# Altium project FMC_SDR_XFE.PrjPcb (part 1 of 2)
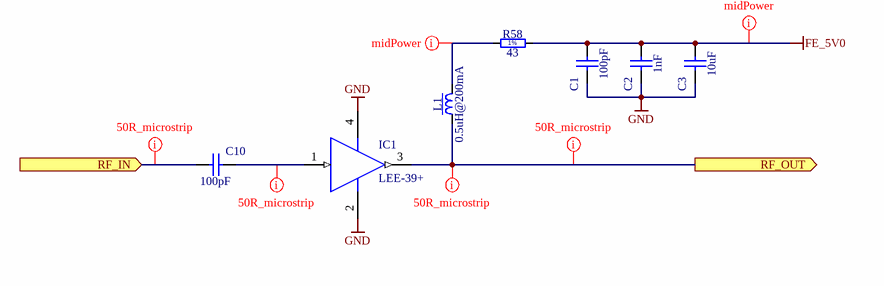
[diagram p0: Preamp.SchDoc]
7 sheets, 141 parts. Net scope: hierarchical (ports join the sheet entries above them; power ports are global).
Board file: FMC_SDR_XFE.PcbDoc
Sheets:
  Preamp.SchDoc
  FrontEnd_PS.SchDoc
    INV_neg5V_PA = LTM8074neg_PA.SchDoc
    INV_neg5V = LTM8074neg.SchDoc
    FE_LDOs = FE_LDOs.SchDoc
    FE_PA_LDOs = FE_PA_LDOs.SchDoc
      PA_LDO = LT3080.SchDoc

## Sheet Preamp.SchDoc: FMC SDR Frontend
size 420 x 297 mm; CheckedBy: -; CompanyName: CERN; DrawnBy: DrawnBy; Organization: CERN; Address1: European Organization for Nuclear Research; Address2: CH-1211 Genčve 23 - Switzerland; Revision: -; SheetNumber: -; SheetTotal: -; EDA_Number: EDA-XXXXX-VX-X; Projet: -; ModifiedBy: -; CreateDate: XX/XX/XXXX; CheckedDate: -; Title2: Preamplifier - general GND reference; DivGrp: TE/MPE; Designer: Designer; ModifiedDate: -

### Parts
C1  100pF  [CAPC1005X55N]
C2  1nF  [CAPC1005X55N]
C3  10uF  [CAPC3216X180N]
C10  100pF  [CAPC1005X55N]
IC1  LEE-39+  [MINI-CIRCUITS_FG873]
L1  0.5uH@200mA  [IND_MINI-CIRCUITS_GU1604]
R58  43  [RESC1608X55N]

### Ports
RF_IN (in), RF_OUT (out)

### Nets
FE_5V0: C1.2 C2.2 C3.2 R58.2
GND: C1.1 C2.1 C3.1 IC1.2(GND) IC1.4(GND)
NetC10_1: C10.1 ; port RF_IN
NetC10_2: C10.2 IC1.1(RF_IN)
NetIC1_3: IC1.3(RF_OUT) L1.1 ; port RF_OUT
NetL1_3: L1.3 R58.1

### Layout directives
net class midPower: FE_5V0, NetL1_3
net class 50R_class: NetC10_1, NetC10_2, NetIC1_3
net class 50R_class; rule Clearance Constraint [Generic clearance = 0.15mm, and 26 value(s) for objects]: NetIC1_3

### Notes on the sheet
- Project/Equipment
- Document
- Designer
- Drawn by
- Check.by
- File
- Last Mod.
- Print Date
- Sheet
- Size
- A3
- of
- Rev
- (in symbol R0603_43R_1%_0.1W_100PPM) 1%

### Library data of the parts
C1 C10 = CC0402_100PF_50V_5%_C0G: Non-polarised capacitor; Part Description: SMD Multilayer Chip Ceramic Capacitor; Manufacturer: GENERIC; Manufacturer1 Part Number: C0402C101J5GACTU; Voltage: 50V; TC: C0G/NP0; Tolerance: ±5%; Part Number: CC0402_100PF_50V_5%_C0G; Component Kind: Standard; Component Type: Standard; Pin Count: 2; Value: 100pF; Status: Preferred; Manufacturer Part Number: CC0402_100PF_50V_5%_C0G; Case: 0402; Mounted: Yes; Socket: No; SMD: Yes; Sense: No; Manufacturer1 Example: KEMET; Manufacturer1 ComponentHeight: 0.55mm; HelpURL: \\cern.ch\dfs\Applications\Altium\Datasheets\CC0805_C0G_KEMET_(Commercial Grade).pdf; Author: CERN DEM JLC; CreateDate: 03.12.2007; LatestRevisionDate: 22.04.2015
C2 = CC0402_1NF_50V_10%_X7R: Non-polarised capacitor; Part Description: SMD Multilayer Chip Ceramic Capacitor; Manufacturer: GENERIC; Manufacturer1 Part Number: 223858715623; Voltage: 50V; TC: X7R; Tolerance: ±10%; Part Number: CC0402_1NF_50V_10%_X7R; Component Kind: Standard; Component Type: Standard; Pin Count: 2; Value: 1nF; Status: Not Recommended; Manufacturer Part Number: CC0402_1NF_50V_10%_X7R; Case: 0402; Mounted: Yes; Socket: No; SMD: Yes; Sense: No; Manufacturer1 Example: PHYCOMP; Manufacturer1 ComponentHeight: 0.55mm; HelpURL: \\cern.ch\dfs\Applications\Altium\Datasheets\CC0402_X7R_PHYCOMP.pdf; Author: CERN DEM JLC; CreateDate: 03.12.2007; LatestRevisionDate: 03.12.2007
C3 = CC1206_10UF_25V_10%_X7R: Non-polarised capacitor; Part Description: SMD Multilayer Chip Ceramic Capacitor; Manufacturer: GENERIC; Manufacturer1 Part Number: C1206C106K4RACTU; Voltage: 25V; TC: X7R; Tolerance: ±10%; Part Number: CC1206_10UF_25V_10%_X7R; Component Kind: Standard; Component Type: Standard; Pin Count: 2; Value: 10uF; Status: Preferred; Manufacturer Part Number: CC1206_10uF_25V_10%_X7R; Case: 1206; Mounted: Yes; Socket: No; SMD: Yes; Sense: No; Manufacturer1 Example: KEMET; Manufacturer1 ComponentHeight: 1.8mm; HelpURL: \\cern.ch\dfs\Applications\Altium\Datasheets\CC1206_X7R_KEMET.pdf; Author: CERN DEM JLC; CreateDate: 12.09.2012; LatestRevisionDate: 12.09.2012
IC1 = LEE-39+: Monolithic Amplifier; Part Description: DC-8GHz Monolithic Amplifier; Manufacturer: MINI-CIRCUITS; PressFit: No; Bonding: No; Part Number: LEE-39+; Component Kind: Standard; Component Type: Standard; Device: LEE-39+; PackageDescription: MINI-CIRCUITS FG873 Case, 4 pin, 3.0mm W X 3.0mm L; Manufacturer Part Number: LEE-39+; Pin Count: 4; Mounted: Yes; Socket: No; SMD: Yes; Sense: No; ComponentHeight: 0.89mm; Author: CERN DEM JLC; HelpURL: \\cern.ch\dfs\Applications\Altium\Datasheets\LEE-39+.pdf; ComponentLink1URL: \\cern.ch\dfs\Applications\Altium\Datasheets\LEE-39+_Package-Drawing.pdf; ComponentLink1Description: Package Drawing; CreateDate: 17.01.2017; LatestRevisionDate: 17.01.2017
L1 = IND_MINI-CIRCUITS_TCCH-80+: 50 Ohms, 50 to 8200 MHz RF Choke; Power: 200mA; Resistance: 0.1R; Part Number: IND_MINI-CIRCUITS_TCCH-80+; Component Kind: Standard; Component Type: Standard; Pin Count: 4; Value: 0.5uH@200mA; Status: None; Part Description: 50 Ohms, 50 to 8200 MHz RF Choke; Manufacturer: MINI-CIRCUITS; Manufacturer Part Number: TCCH-80+; Mounted: Yes; Socket: No; SMD: Yes; Sense: No; ComponentHeight: 3.81mm; HelpURL: \\cern.ch\dfs\Applications\Altium\Datasheets\IND_MINI-CIRCUITS_TCCH-80+.pdf; Author: CERN DEM JLC; CreateDate: 19.12.2011; LatestRevisionDate: 19.12.2011
R58 = R0603_43R_1%_0.1W_100PPM: Resistor - 1%; Part Description: General Purpose Thick Film Chip Resistor; Manufacturer: GENERIC; Manufacturer1 Part Number: NRC06F43R0TRF; Power: 0.1W; TC: ±100ppm/°C; PressFit: No; Part Number: R0603_43R_1%_0.1W_100PPM; Component Kind: Standard; Component Type: Standard; Pin Count: 2; Value: 43; Status: Preferred; Tolerance: ±1%; Manufacturer Part Number: R0603_43R_1%_0.1W_100PPM; Case: 0603; Mounted: Yes; Sense: No; Socket: No; SMD: Yes; Manufacturer1 Example: NIC COMPONENT; Manufacturer1 ComponentHeight: 0.55mm; HelpURL: \\cern.ch\dfs\Applications\Altium\Datasheets\R0603_NIC_NRC.pdf; Author: CERN DEM JLC; CreateDate: 03.12.2007; LatestRevisionDate: 13.03.2008

## Sheet FrontEnd_PS.SchDoc: FMC SDR Frontend
size 420 x 297 mm; CheckedBy: -; CompanyName: CERN; DrawnBy: DrawnBy; Organization: CERN; Address1: European Organization for Nuclear Research; Address2: CH-1211 Genčve 23 - Switzerland; Revision: -; SheetNumber: -; SheetTotal: -; EDA_Number: EDA-XXXXX-VX-X; Projet: -; ModifiedBy: -; CreateDate: XX/XX/XXXX; CheckedDate: -; Title2: Power Supply Top sheet; DivGrp: TE/MPE; Designer: Designer; ModifiedDate: -
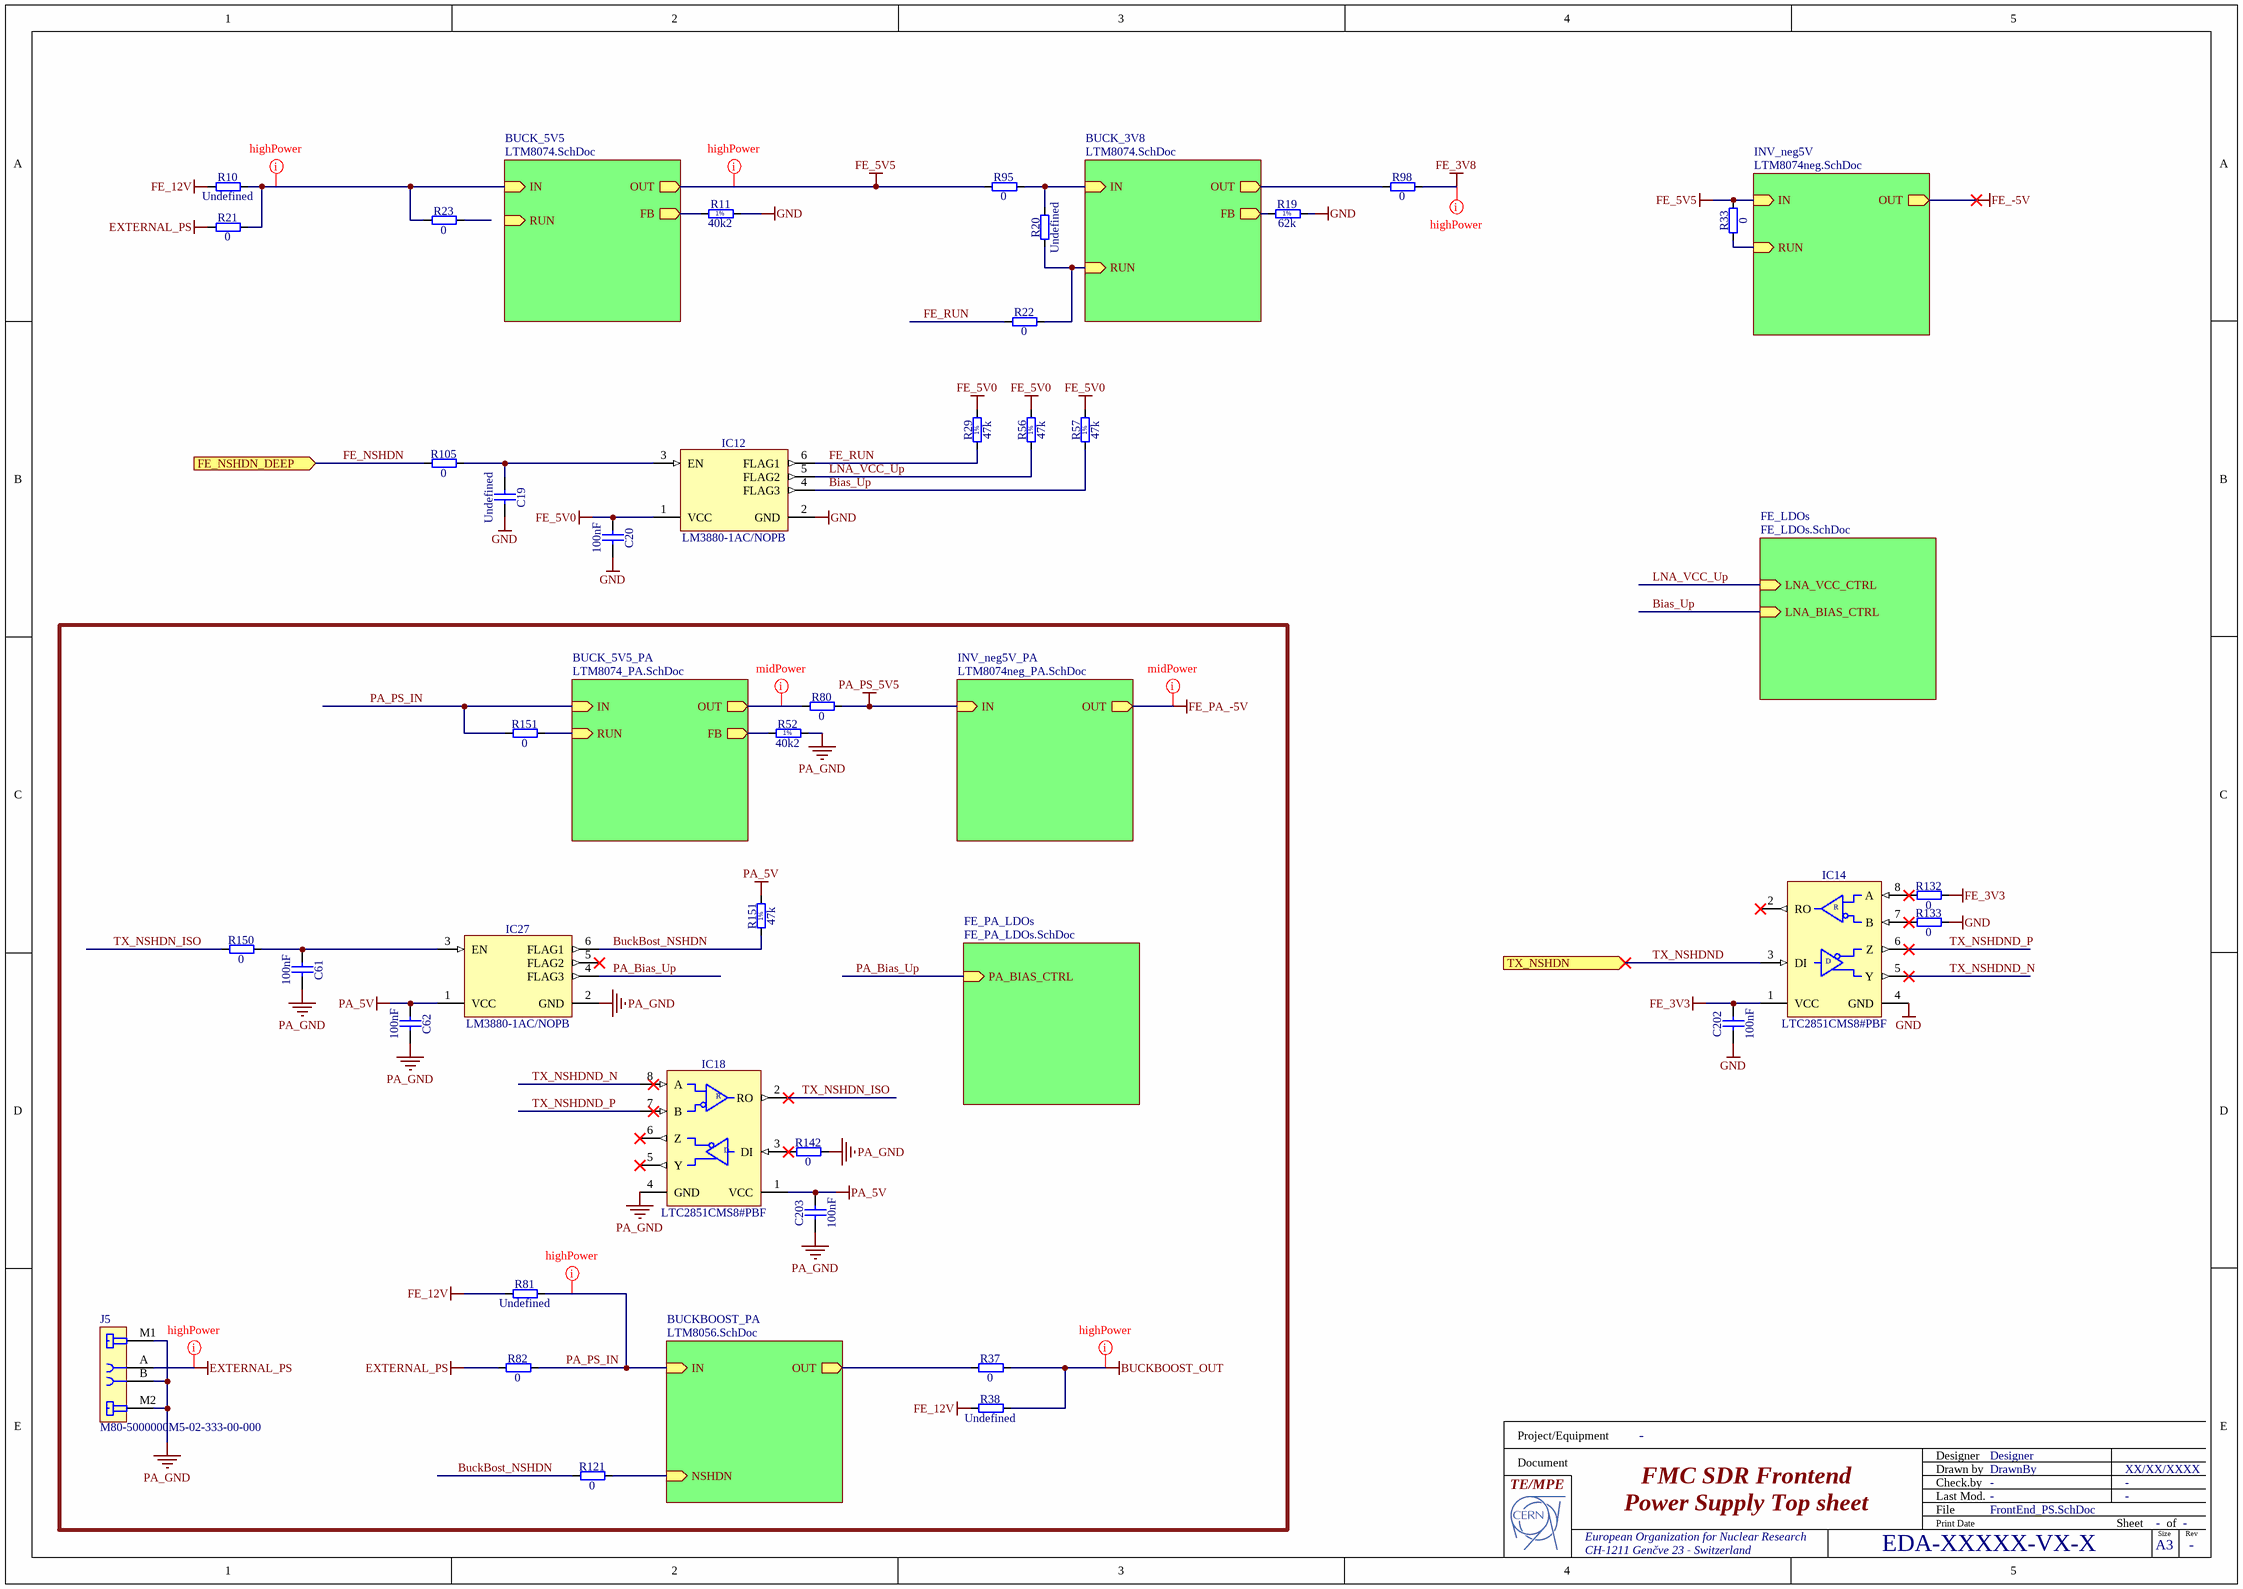
[diagram p1: FrontEnd_PS.SchDoc]

### Parts
(Parts that share a designator on the sheet are numbered #1, #2 ... from top to bottom, then left to right.)
C19  Undefined  [CAPC1005X55N]
C20  100nF  [CAPC1005X55N]
C61  100nF  [CAPC1005X55N]
C62  100nF  [CAPC1005X55N]
C202  100nF  [CAPC1005X55N]
C203  100nF  [CAPC1005X55N]
IC12  LM3880-1AC/NOPB  [SOT95P280X145-6N]
IC14  LTC2851CMS8#PBF  [SOP65P490X110-8N]
IC18  LTC2851CMS8#PBF  [SOP65P490X110-8N]
IC27  LM3880-1AC/NOPB  [SOT95P280X145-6N]
J5  M80-5000000M5-02-333-00-000  [M80-5000000M5-02-333-00-000]
R10  Undefined  [RESC3216X65N]
R11  40k2  [RESC2012X60N]
R19  62k  [RESC2012X60N]
R20  Undefined  [RESC1608X55N]
R21  0  [RESC3216X65N]
R22#1  0  [RESC1608X55N]
R23#1  0  [RESC1608X55N]
R29  47k  [RESC1608X55N]
R33  0  [RESC1608X55N]
R37  0  [RESC3216X65N]
R38  Undefined  [RESC3216X65N]
R52  40k2  [RESC2012X60N]
R56  47k  [RESC1608X55N]
R57  47k  [RESC1608X55N]
R80  0  [RESC3216X65N]
R81  Undefined  [RESC3216X65N]
R82  0  [RESC3216X65N]
R95  0  [RESC3216X65N]
R98  0  [RESC3216X65N]
R105  0  [RESC1608X55N]
R121  0  [RESC1608X55N]
R132  0  [RESC1608X55N]
R133  0  [RESC1608X55N]
R142  0  [RESC1608X55N]
R150  0  [RESC1608X55N]
R151#1  0  [RESC1608X55N]
R151#2  47k  [RESC1608X55N]

### Sub-sheets
BUCK_3V8 = LTM8074.SchDoc (file not in this document): IN (in), OUT (out), FB (out), RUN (in)
BUCK_5V5 = LTM8074.SchDoc (file not in this document): IN (in), OUT (out), FB (out), RUN (in)
BUCK_5V5_PA = LTM8074_PA.SchDoc (file not in this document): IN (in), OUT (out), FB (out), RUN (in)
BUCKBOOST_PA = LTM8056.SchDoc (file not in this document): IN (in), OUT (out), NSHDN (in)
FE_LDOs = FE_LDOs.SchDoc: LNA_VCC_CTRL (in), LNA_BIAS_CTRL (in)
FE_PA_LDOs = FE_PA_LDOs.SchDoc: PA_BIAS_CTRL (in)
INV_neg5V = LTM8074neg.SchDoc: IN (in), OUT (out), RUN (in)
INV_neg5V_PA = LTM8074neg_PA.SchDoc: IN (in), OUT (out)

### Ports
FE_NSHDN_DEEP (in), TX_NSHDN (in)

### Nets
BUCKBOOST_OUT: R37.2 R38.2
EXTERNAL_PS: J5.A R21.1 R82.1
FE_3V3: C202.2 IC14.1(VCC) R132.2
FE_3V8: R98.2
FE_5V0: C20.2 IC12.1(VCC) R29.2 R56.2 R57.2
FE_5V5: R33.2 R95.1 ; sheet INV_neg5V/IN, sheet BUCK_5V5/OUT
FE_12V: R10.1 R38.1 R81.1
GND: C19.1 C20.1 C202.1 IC12.2(GND) IC14.4(GND) R11.2 R19.2 R133.2
PA_5V: C62.2 C203.2 IC18.1(VCC) IC27.1(VCC) R151#2.2
PA_GND: C61.1 C62.1 C203.1 IC18.4(GND) IC27.2(GND) J5.B J5.M1 J5.M2 R52.2 R142.2
PA_PS_5V5: R80.2 ; sheet INV_neg5V_PA/IN
Bias_Up: IC12.4(FLAG3) R57.1 ; sheet FE_LDOs/LNA_BIAS_CTRL
BuckBost_NSHDN: IC27.6(FLAG1) R121.1 R151#2.1
FE_NSHDN: R105.1 ; port FE_NSHDN_DEEP
FE_RUN: IC12.6(FLAG1) R22#1.1 R29.1
LNA_VCC_Up: IC12.5(FLAG2) R56.1 ; sheet FE_LDOs/LNA_VCC_CTRL
PA_Bias_Up: IC27.4(FLAG3) ; sheet FE_PA_LDOs/PA_BIAS_CTRL
PA_PS_IN: R81.2 R82.2 R151#1.1 ; sheet BUCKBOOST_PA/IN, sheet BUCK_5V5_PA/IN
TX_NSHDN_ISO: IC18.2(RO) R150.1
TX_NSHDND: IC14.3(DI) ; port TX_NSHDN
TX_NSHDND_N: IC14.5(Y) IC18.8(A)
TX_NSHDND_P: IC14.6(Z) IC18.7(B)
NetC19_2: C19.2 IC12.3(EN) R105.2
NetC61_2: C61.2 IC27.3(EN) R150.2
NetIC13_A2: R33.1 ; sheet INV_neg5V/RUN
NetIC14_7: IC14.7(B) R133.1
NetIC14_8: IC14.8(A) R132.1
NetIC18_3: IC18.3(DI) R142.1
NetR10_2: R10.2 R21.2 R23#1.1 ; sheet BUCK_5V5/IN
NetR11_1: R11.1 ; sheet BUCK_5V5/FB
NetR19_1: R19.1 ; sheet BUCK_3V8/FB
NetR20_1: R20.1 R22#1.2 ; sheet BUCK_3V8/RUN
NetR20_2: R20.2 R95.2 ; sheet BUCK_3V8/IN
NetR37_1: R37.1 ; sheet BUCKBOOST_PA/OUT
NetR52_1: R52.1 ; sheet BUCK_5V5_PA/FB
NetR80_1: R80.1 ; sheet BUCK_5V5_PA/OUT
NetR98_1: R98.1 ; sheet BUCK_3V8/OUT
NetR121_2: R121.2 ; sheet BUCKBOOST_PA/NSHDN
NetR151#1_2: R151#1.2 ; sheet BUCK_5V5_PA/RUN

Not connected (* = marked no-connect by the designer): IC14 2(RO)*; IC18 5(Y)* 6(Z)*; IC27 5(FLAG2)*; R23#1 2

### Layout directives
net class highPower: BUCKBOOST_OUT, EXTERNAL_PS, FE_3V8, FE_5V5, NetR10_2, PA_PS_IN
net class midPower: FE_PA_-5V, NetR80_1

### Notes on the sheet
- (near R37) Now 20V.
- Project/Equipment
- Document
- Designer
- Drawn by
- Check.by
- File
- Last Mod.
- Print Date
- Sheet
- Size
- A3
- of
- Rev
- (in symbol LTC2851CMS8#PBF) R; D
- (in symbol R0603_47K_1%_0.1W_100PPM) 1%
- (in symbol R0805_40K2_1%_0.125W_100PPM) 1%
- (in symbol R0805_62K_1%_0.125W_100PPM) 1%

### Library data of the parts
C19 = CC0402_NO-VALUE: Non-polarised capacitor; Part Description: Reserved Footprint For 0402(1005) Chip Ceramic Capacitor; Mounted: No; Part Number: CC0402_NO-VALUE; Component Kind: Standard; Component Type: Standard; Pin Count: 2; Value: Undefined; Status: None; Manufacturer: Undefined; Manufacturer Part Number: CC0402_NO-VALUE; Case: 0402; Socket: No; SMD: Yes; Sense: No; Manufacturer1 ComponentHeight: 0.55mm; HelpURL: Undefined; Author: CERN DEM JLC; CreateDate: 14.01.2014; LatestRevisionDate: 14.01.2014
C20 C61 C62 C202 C203 = CC0402_100NF_16V_10%_X7R: Non-polarised capacitor; Part Description: SMD Multilayer Chip Ceramic Capacitor; Manufacturer: GENERIC; Manufacturer1 Part Number: GRM155R71C104KA88D; Voltage: 16V; TC: X7R; Tolerance: ±10%; Part Number: CC0402_100NF_16V_10%_X7R; Component Kind: Standard; Component Type: Standard; Pin Count: 2; Value: 100nF; Status: Not Recommended; Manufacturer Part Number: CC0402_100NF_16V_10%_X7R; Case: 0402; Mounted: Yes; Socket: No; SMD: Yes; Sense: No; Manufacturer1 Example: MURATA; Manufacturer1 ComponentHeight: 0.55mm; HelpURL: \\cern.ch\dfs\Applications\Altium\Datasheets\CC0402_X7R_MURATA_GRM.pdf; Author: CERN DEM JLC; CreateDate: 05.12.2013; LatestRevisionDate: 03.12.2007
IC12 IC27 = LM3880-1AC/NOPB: Simple Power Sequencer; Part Description: Simple Power Sequencer, Power UP : 1 2 3, Power Down 3 2 1, Timing Designator 60ms; Manufacturer: TEXAS INSTRUMENTS; PressFit: No; Bonding: No; Part Number: LM3880-1AC/NOPB; Component Kind: Standard; Component Type: Standard; Device: LM3880-1AC/NOPB; PackageDescription: SOT23, 6-Leads, Body 1.6x3.0mm, Pitch 0.95mm, IPC Medium Density; Manufacturer Part Number: LM3880-1AC/NOPB; Pin Count: 6; Case: SOT23-6; Mounted: Yes; Socket: No; SMD: Yes; Sense: No; ComponentHeight: 1.45mm; Author: CERN DEM MR; HelpURL: \\cern.ch\dfs\Applications\Altium\Datasheets\LM3880-1AC-NOPB.pdf; CreateDate: 17.03.2016; LatestRevisionDate: 17.03.2016
IC14 IC18 = LTC2851CMS8#PBF: 3.3V 20Mbps RS485/RS422 Transceivers; Manufacturer: LINEAR TECHNOLOGY; PressFit: No; Bonding: No; Part Number: LTC2851CMS8#PBF; Component Kind: Standard; Component Type: Standard; Device: LTC2851CMS8#PBF; PackageDescription: SOP, 0.65mm pitch; 8 pin, 3.00mm W X 3.00mm L X 1.10mm H body, IPC Medium Density; Part Description: 3.3V 20Mbps RS485/RS422 Transceivers; Manufacturer Part Number: LTC2851CMS8#PBF; Pin Count: 8; Case: MSOP8; Mounted: Yes; Socket: No; SMD: Yes; Sense: No; ComponentHeight: 1.1mm; HelpURL: \\cern.ch\dfs\Applications\Altium\Datasheets\LTC2851CMS8#PBF.pdf; Author: CERN DEM JLC; CreateDate: 14.12.2010; LatestRevisionDate: 14.12.2010
J5 = CON_M80-5000000M5-02-333-00-000: 2pin (2 power), THT socket with M2 jackscrews; Manufacturer: Harwin; Part Number: M80-5L10405M5-02-333-00-000; Bonding: No; ComponentHeigth: 6.05mm; PressFit: No; Case: M80-5000000M5-02-333-00-000; Component Kind: Standard; Component Type: Standard; CreateDate: 2018-06-18; Device: M80-5000000M5-02-333-00-000; HelpURL: https://www.harwin.com/products/M80-5000000M5-02-333-00-000/; LatestRevisionDate: 2018-06-18; Manufacturer Part Number: M80-5000000M5-02-333-00-000; Mounted: Yes; PackageDescription: H=6.05mm, W=18mm, D=8.6mm; Part Description: 2pin (2 power), THT socket with M2 jackscrews; Pin Count: 6; Sense: No; SMD: No; Socket: No; Value: *
R10 R38 R81 = R1206_NO-VALUE: Resistor; Part Description: Reserved Footprint For a 1206 (3216) Chip Resistor; PressFit: No; Mounted: No; Part Number: R1206_NO-VALUE; Component Kind: Standard; Component Type: Standard; Pin Count: 2; Value: Undefined; Status: None; Manufacturer: Undefined; Manufacturer Part Number: R1206_NO-VALUE; Case: 1206; Sense: No; Socket: No; SMD: Yes; Manufacturer1 Example: Undefined; Manufacturer1 Part Number: Undefined; Manufacturer1 ComponentHeight: 0.65mm; HelpURL: Undefined; Author: CERN DEM JLC; CreateDate: 03.12.2007; LatestRevisionDate: 13.03.2008
R11 R52 = R0805_40K2_1%_0.125W_100PPM: Resistor - 1%; Part Description: Thick Film Chip Resistor; Manufacturer: VISHAY; Manufacturer1 Part Number: CRCW080540K2FKEA; Power: 0.125W; TC: ±100ppm/°C; PressFit: No; Part Number: R0805_40K2_1%_0.125W_100PPM; Component Kind: Standard; Component Type: Standard; Pin Count: 2; Value: 40k2; Status: None; Tolerance: ±1%; Manufacturer Part Number: R0805_40K2_1%_0.125W_100PPM; Case: 0805; Mounted: Yes; Sense: No; Socket: No; SMD: Yes; Manufacturer1 Example: VISHAY; Manufacturer1 ComponentHeight: 0.6mm; HelpURL: \\cern.ch\dfs\Applications\Altium\Datasheets\R2512_VISHAY_CRCW0805.pdf; Author: CERN DEM JLC; CreateDate: 18.04.2013; LatestRevisionDate: 18.04.2013
R19 = R0805_62K_1%_0.125W_100PPM: Resistor - 1%; Part Description: General Purpose Thick Film Chip Resistor; Manufacturer: GENERIC; Manufacturer1 Part Number: NRC10F6202TRF; Power: 0.125W; TC: ±100ppm/°C; PressFit: No; Part Number: R0805_62K_1%_0.125W_100PPM; Component Kind: Standard; Component Type: Standard; Pin Count: 2; Value: 62k; Status: Preferred; Tolerance: ±1%; Manufacturer Part Number: R0805_62K_1%_0.125W_100PPM; Case: 0805; Mounted: Yes; Sense: No; Socket: No; SMD: Yes; Manufacturer1 Example: NIC COMPONENT; Manufacturer1 ComponentHeight: 0.6mm; HelpURL: \\cern.ch\dfs\Applications\Altium\Datasheets\R0805_NIC_NRC.pdf; Author: CERN DEM JLC; CreateDate: 03.12.2007; LatestRevisionDate: 13.03.2008
R20 = R0603_NO-VALUE: Resistor; Part Description: Reserved Footprint For a 0603 (1608) Chip Resistor; PressFit: No; Mounted: No; Part Number: R0603_NO-VALUE; Component Kind: Standard; Component Type: Standard; Pin Count: 2; Value: Undefined; Status: None; Manufacturer: Undefined; Manufacturer Part Number: R0603_NO-VALUE; Case: 0603; Sense: No; Socket: No; SMD: Yes; Manufacturer1 Example: Undefined; Manufacturer1 Part Number: Undefined; Manufacturer1 ComponentHeight: Undefined; HelpURL: Undefined; Author: CERN DEM JLC; CreateDate: 03.12.2007; LatestRevisionDate: 13.03.2008
R21 R37 R80 R82 R95 R98 = R1206_0R_JUMPER: Resistor; Part Description: 2A (0.05R Max DC Resistance) Zero Ohm Jumper; Manufacturer: GENERIC; Manufacturer1 Part Number: NRC12Z0; PressFit: No; Part Number: R1206_0R_JUMPER; Component Kind: Standard; Component Type: Standard; Pin Count: 2; Value: 0; Status: Preferred; Manufacturer Part Number: R1206_0R_JUMPER; Case: 1206; Mounted: Yes; Sense: No; Socket: No; SMD: Yes; Manufacturer1 Example: NIC COMPONENT; Manufacturer1 ComponentHeight: 0.65mm; HelpURL: \\cern.ch\dfs\Applications\Altium\Datasheets\R1206_NIC_NRC.pdf; Author: CERN DEM JLC; CreateDate: 03.12.2007; LatestRevisionDate: 13.03.2008
R22#1 R23#1 R33 R105 R121 R132 R133 R142 R150 R151#1 = R0603_0R_JUMPER: Resistor; Part Description: 1A (0.05R Max DC Resistance) Zero Ohm Jumper; Manufacturer: GENERIC; Manufacturer1 Part Number: NRC06Z0; PressFit: No; Part Number: R0603_0R_JUMPER; Component Kind: Standard; Component Type: Standard; Pin Count: 2; Value: 0; Status: Preferred; Manufacturer Part Number: R0603_0R_JUMPER; Case: 0603; Mounted: Yes; Sense: No; Socket: No; SMD: Yes; Manufacturer1 Example: NIC COMPONENT; Manufacturer1 ComponentHeight: 0.55mm; HelpURL: \\cern.ch\dfs\Applications\Altium\Datasheets\R0603_NIC_NRC.pdf; Author: CERN DEM JLC; CreateDate: 03.12.2007; LatestRevisionDate: 13.03.2008
R29 R56 R57 R151#2 = R0603_47K_1%_0.1W_100PPM: Resistor - 1%; Part Description: General Purpose Thick Film Chip Resistor; Manufacturer: GENERIC; Manufacturer1 Part Number: NRC06F4702TRF; PressFit: No; Power: 0.1W; TC: ±100ppm/°C; Part Number: R0603_47K_1%_0.1W_100PPM; Component Kind: Standard; Component Type: Standard; Pin Count: 2; Value: 47k; Status: Preferred; Manufacturer Part Number: R0603_47K_1%_0.1W_100PPM; Case: 0603; Mounted: Yes; Sense: No; Socket: No; SMD: Yes; Manufacturer1 Example: NIC COMPONENT; Manufacturer1 ComponentHeight: 0.55mm; HelpURL: \\cern.ch\dfs\Applications\Altium\Datasheets\R0603_NIC_NRC.pdf; Author: CERN DEM JLC; CreateDate: 03.12.2007; LatestRevisionDate: 13.03.2008; Tolerance: ±1%

## Sheet LTM8074neg_PA.SchDoc: FMC SDR Frontend
size 420 x 297 mm; CheckedBy: -; CompanyName: CERN; DrawnBy: DrawnBy; Organization: CERN; Address1: European Organization for Nuclear Research; Address2: CH-1211 Genčve 23 - Switzerland; Revision: -; SheetNumber: -; SheetTotal: -; EDA_Number: EDA-XXXXX-VX-X; Projet: -; ModifiedBy: -; CreateDate: XX/XX/XXXX; CheckedDate: -; Title2: LTM874 - negative, PA GND; DivGrp: TE/MPE; Designer: Designer; ModifiedDate: -
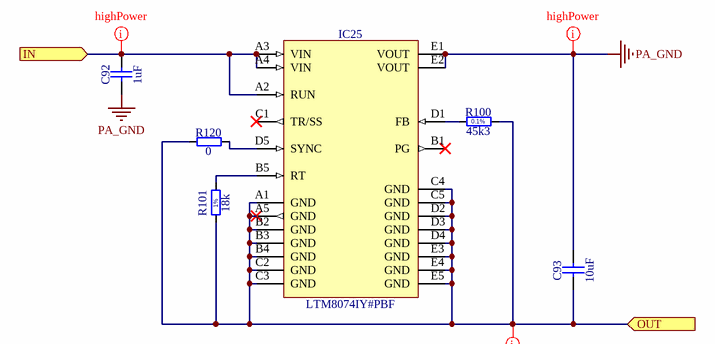
[diagram p2: LTM8074neg_PA.SchDoc]

### Parts
C92  1uF  [CAPC2012X110N]
C93  10uF  [CAPC2012X95N]
IC25  LTM8074IY#PBF  [BGA25C65P5X5_400X400X198]
R100  45k3  [RESC1608X55N]
R101  18k  [RESC1608X55N]
R120  0  [RESC1608X55N]

### Ports
IN (in), OUT (in)

### Nets
FE_PA_-5V: C93.1 IC25.A1(GND) IC25.A5(GND) IC25.B2(GND) IC25.B3(GND) IC25.B4(GND) IC25.C2(GND) IC25.C3(GND) IC25.C4(GND) IC25.C5(GND) IC25.D2(GND) IC25.D3(GND) IC25.D4(GND) IC25.E3(GND) IC25.E4(GND) IC25.E5(GND) R100.2 R101.1 R120.1 ; port OUT
PA_GND: C92.1 C93.2 IC25.E1(VOUT) IC25.E2(VOUT)
PA_PS_5V5: C92.2 IC25.A2(RUN) IC25.A3(VIN) IC25.A4(VIN) ; port IN
NetIC25_B5: IC25.B5(RT) R101.2
NetIC25_D1: IC25.D1(FB) R100.1
NetIC25_D5: IC25.D5(SYNC) R120.2

Not connected (* = marked no-connect by the designer): IC25 B1(PG)* C1(TR/SS)*

### Layout directives
net class highPower: FE_PA_-5V, PA_GND, PA_PS_5V5

### Notes on the sheet
- Project/Equipment
- Document
- Designer
- Drawn by
- Check.by
- File
- Last Mod.
- Print Date
- Sheet
- Size
- A3
- of
- Rev
- (in symbol R0603_18K_1%_0.1W_100PPM) 1%
- (in symbol R0603_45K3_0.1%_0.063W_10PPM) 0.1%

### Library data of the parts
C92 = CC0805_1UF_50V_10%_X7R: Non-polarised capacitor; Part Description: SMD Multilayer Chip Ceramic Capacitor; Manufacturer: GENERIC; Manufacturer1 Part Number: C0805C105K5RACTU; Voltage: 50V; TC: X7R; Tolerance: ±10%; Part Number: CC0805_1UF_50V_10%_X7R; Component Kind: Standard; Component Type: Standard; Pin Count: 2; Value: 1uF; Status: Preferred; Manufacturer Part Number: CC0805_1UF_50V_10%_X7R; Case: 0805; Mounted: Yes; Socket: No; SMD: Yes; Sense: No; Manufacturer1 Example: KEMET; Manufacturer1 ComponentHeight: 1.1mm; HelpURL: \\cern.ch\dfs\Applications\Altium\Datasheets\CC0805_X7R_KEMET.pdf; Author: CERN DEM JLC; CreateDate: 04.12.2013; LatestRevisionDate: 04.12.2013
C93 = CC0805_10UF_25V_10%_X5R: Non-polarised capacitor; Part Description: SMD Multilayer Chip Ceramic Capacitor; Manufacturer: GENERIC; Manufacturer1 Part Number: GRM219R61E106KA12D; Voltage: 25V; TC: X5R; Tolerance: ±10%; Part Number: CC0805_10UF_25V_10%_X5R; Component Kind: Standard; Component Type: Standard; Pin Count: 2; Value: 10uF; Status: Preferred; Manufacturer Part Number: CC0805_10UF_25V_10%_X5R; Case: 0805; Mounted: Yes; Socket: No; SMD: Yes; Sense: No; Manufacturer1 Example: MURATA; Manufacturer1 ComponentHeight: 0.95mm; HelpURL: \\cern.ch\dfs\Applications\Altium\Datasheets\CC0805_X5R_MURATA_GRM.pdf; Author: CERN DEM JLC; CreateDate: 25.10.2012; LatestRevisionDate: 06.09.2016
IC25 = LTM8074IY#PBF: 40VIN, 1.2A Silent Switcher µModule Regulator; Manufacturer: LINEAR TECHNOLOGY; PressFit: No; Bonding: No; Part Number: LTM8074IY#PBF; Component Kind: Standard; Component Type: Standard; Device: LTM8074IY#PBF; PackageDescription: BGA, 0.65mm Pitch, Square; 25 Pin, 5 Columns X 5 Rows, 4.00mm X 4.00mm X 1.98mm H; Part Description: 40VIN, 1.2A Silent Switcher µModule Regulator; Manufacturer Part Number: LTM8074IY#PBF; Pin Count: 25; Case: BGA25; Mounted: Yes; Socket: No; SMD: Yes; Sense: No; ComponentHeight: 1.98mm; HelpURL: \\cern.ch\dfs\Applications\Altium\Datasheets\LTM8074IY#PBF.pdf; Author: CERN DEM JLC; CreateDate: 08.04.2019; LatestRevisionDate: 08.04.2019
R100 = R0603_45K3_0.1%_0.063W_10PPM: Resistor - 0.1%; Part Description: Thin Film Chip Resistor; Manufacturer: GENERIC; Manufacturer1 Part Number: RN73C1J45K3BTDF; Power: 0.063W; TC: ±10ppm; PressFit: No; Part Number: R0603_45K3_0.1%_0.063W_10PPM; Component Kind: Standard; Component Type: Standard; Pin Count: 2; Value: 45k3; Status: Not Recommended; Tolerance: ±0.1%; Manufacturer Part Number: R0603_45K3_0.1%_0.063W_10PPM; Case: 0603; Mounted: Yes; Sense: No; Socket: No; SMD: Yes; Manufacturer1 Example: TYCO HOLSWORTHY; Manufacturer1 ComponentHeight: 0.5mm; HelpURL: \\cern.ch\dfs\Applications\Altium\Datasheets\R0603_Tyco_RN73.pdf; Author: CERN DEM JLC; CreateDate: 03.12.2007; LatestRevisionDate: 13.03.2008
R101 = R0603_18K_1%_0.1W_100PPM: Resistor - 1%; Part Description: General Purpose Thick Film Chip Resistor; Manufacturer: GENERIC; Manufacturer1 Part Number: NRC06F1802TRF; Power: 0.1W; TC: ±100ppm/°C; PressFit: No; Part Number: R0603_18K_1%_0.1W_100PPM; Component Kind: Standard; Component Type: Standard; Pin Count: 2; Value: 18k; Status: Preferred; Tolerance: ±1%; Manufacturer Part Number: R0603_18K_1%_0.1W_100PPM; Case: 0603; Mounted: Yes; Sense: No; Socket: No; SMD: Yes; Manufacturer1 Example: NIC COMPONENT; Manufacturer1 ComponentHeight: 0.55mm; HelpURL: \\cern.ch\dfs\Applications\Altium\Datasheets\R0603_NIC_NRC.pdf; Author: CERN DEM JLC; CreateDate: 03.12.2007; LatestRevisionDate: 13.03.2008
R120 = R0603_0R_JUMPER: as R22#1 on sheet FrontEnd_PS; Part Number: R0603_0R_JUMPER; Component Kind: Standard; Component Type: Standard; Pin Count: 2; Value: 0; Status: Preferred; Manufacturer Part Number: R0603_0R_JUMPER; Case: 0603; Mounted: Yes; Sense: No; Socket: No; SMD: Yes; Manufacturer1 Example: NIC COMPONENT; Manufacturer1 ComponentHeight: 0.55mm; HelpURL: \\cern.ch\dfs\Applications\Altium\Datasheets\R0603_NIC_NRC.pdf; Author: CERN DEM JLC; CreateDate: 03.12.2007; LatestRevisionDate: 13.03.2008

## Sheet LTM8074neg.SchDoc: FMC SDR Frontend
size 420 x 297 mm; CheckedBy: -; CompanyName: CERN; DrawnBy: DrawnBy; Organization: CERN; Address1: European Organization for Nuclear Research; Address2: CH-1211 Genčve 23 - Switzerland; Revision: -; SheetNumber: -; SheetTotal: -; EDA_Number: EDA-XXXXX-VX-X; Projet: -; ModifiedBy: -; CreateDate: XX/XX/XXXX; CheckedDate: -; Title2: LTM874 - negative; DivGrp: TE/MPE; Designer: Designer; ModifiedDate: -
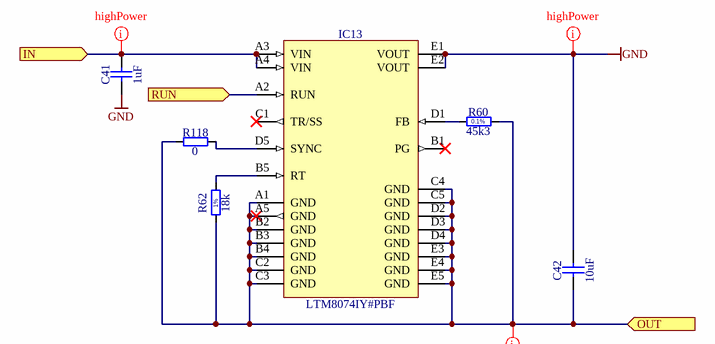
[diagram p3: LTM8074neg.SchDoc]

### Parts
C41  1uF  [CAPC2012X110N]
C42  10uF  [CAPC2012X95N]
IC13  LTM8074IY#PBF  [BGA25C65P5X5_400X400X198]
R60  45k3  [RESC1608X55N]
R62  18k  [RESC1608X55N]
R118  0  [RESC1608X55N]

### Ports
IN (in), OUT (in), RUN (in)

### Nets
FE_5V5: C41.2 IC13.A3(VIN) IC13.A4(VIN) ; port IN
FE_-5V: C42.1 IC13.A1(GND) IC13.A5(GND) IC13.B2(GND) IC13.B3(GND) IC13.B4(GND) IC13.C2(GND) IC13.C3(GND) IC13.C4(GND) IC13.C5(GND) IC13.D2(GND) IC13.D3(GND) IC13.D4(GND) IC13.E3(GND) IC13.E4(GND) IC13.E5(GND) R60.2 R62.1 R118.1 ; port OUT
GND: C41.1 C42.2 IC13.E1(VOUT) IC13.E2(VOUT)
NetIC13_A2: IC13.A2(RUN) ; port RUN
NetIC13_B5: IC13.B5(RT) R62.2
NetIC13_D1: IC13.D1(FB) R60.1
NetIC13_D5: IC13.D5(SYNC) R118.2

Not connected (* = marked no-connect by the designer): IC13 B1(PG)* C1(TR/SS)*

### Layout directives
net class highPower: FE_5V5, FE_-5V, GND

### Notes on the sheet
- Project/Equipment
- Document
- Designer
- Drawn by
- Check.by
- File
- Last Mod.
- Print Date
- Sheet
- Size
- A3
- of
- Rev
- (in symbol R0603_18K_1%_0.1W_100PPM) 1%
- (in symbol R0603_45K3_0.1%_0.063W_10PPM) 0.1%

### Library data of the parts
C41 = CC0805_1UF_50V_10%_X7R: as C92 on sheet LTM8074neg_PA; Part Number: CC0805_1UF_50V_10%_X7R; Component Kind: Standard; Component Type: Standard; Pin Count: 2; Value: 1uF; Status: Preferred; Manufacturer Part Number: CC0805_1UF_50V_10%_X7R; Case: 0805; Mounted: Yes; Socket: No; SMD: Yes; Sense: No; Manufacturer1 Example: KEMET; Manufacturer1 ComponentHeight: 1.1mm; HelpURL: \\cern.ch\dfs\Applications\Altium\Datasheets\CC0805_X7R_KEMET.pdf; Author: CERN DEM JLC; CreateDate: 04.12.2013; LatestRevisionDate: 04.12.2013
C42 = CC0805_10UF_25V_10%_X5R: as C93 on sheet LTM8074neg_PA; Part Number: CC0805_10UF_25V_10%_X5R; Component Kind: Standard; Component Type: Standard; Pin Count: 2; Value: 10uF; Status: Preferred; Manufacturer Part Number: CC0805_10UF_25V_10%_X5R; Case: 0805; Mounted: Yes; Socket: No; SMD: Yes; Sense: No; Manufacturer1 Example: MURATA; Manufacturer1 ComponentHeight: 0.95mm; HelpURL: \\cern.ch\dfs\Applications\Altium\Datasheets\CC0805_X5R_MURATA_GRM.pdf; Author: CERN DEM JLC; CreateDate: 25.10.2012; LatestRevisionDate: 06.09.2016
IC13 = LTM8074IY#PBF: as IC25 on sheet LTM8074neg_PA; Part Number: LTM8074IY#PBF; Component Kind: Standard; Component Type: Standard; Device: LTM8074IY#PBF; PackageDescription: BGA, 0.65mm Pitch, Square; 25 Pin, 5 Columns X 5 Rows, 4.00mm X 4.00mm X 1.98mm H; Part Description: 40VIN, 1.2A Silent Switcher µModule Regulator; Manufacturer Part Number: LTM8074IY#PBF; Pin Count: 25; Case: BGA25; Mounted: Yes; Socket: No; SMD: Yes; Sense: No; ComponentHeight: 1.98mm; HelpURL: \\cern.ch\dfs\Applications\Altium\Datasheets\LTM8074IY#PBF.pdf; Author: CERN DEM JLC; CreateDate: 08.04.2019; LatestRevisionDate: 08.04.2019
R60 = R0603_45K3_0.1%_0.063W_10PPM: as R100 on sheet LTM8074neg_PA; Part Number: R0603_45K3_0.1%_0.063W_10PPM; Component Kind: Standard; Component Type: Standard; Pin Count: 2; Value: 45k3; Status: Not Recommended; Tolerance: ±0.1%; Manufacturer Part Number: R0603_45K3_0.1%_0.063W_10PPM; Case: 0603; Mounted: Yes; Sense: No; Socket: No; SMD: Yes; Manufacturer1 Example: TYCO HOLSWORTHY; Manufacturer1 ComponentHeight: 0.5mm; HelpURL: \\cern.ch\dfs\Applications\Altium\Datasheets\R0603_Tyco_RN73.pdf; Author: CERN DEM JLC; CreateDate: 03.12.2007; LatestRevisionDate: 13.03.2008
R62 = R0603_18K_1%_0.1W_100PPM: as R101 on sheet LTM8074neg_PA; Part Number: R0603_18K_1%_0.1W_100PPM; Component Kind: Standard; Component Type: Standard; Pin Count: 2; Value: 18k; Status: Preferred; Tolerance: ±1%; Manufacturer Part Number: R0603_18K_1%_0.1W_100PPM; Case: 0603; Mounted: Yes; Sense: No; Socket: No; SMD: Yes; Manufacturer1 Example: NIC COMPONENT; Manufacturer1 ComponentHeight: 0.55mm; HelpURL: \\cern.ch\dfs\Applications\Altium\Datasheets\R0603_NIC_NRC.pdf; Author: CERN DEM JLC; CreateDate: 03.12.2007; LatestRevisionDate: 13.03.2008
R118 = R0603_0R_JUMPER: as R22#1 on sheet FrontEnd_PS; Part Number: R0603_0R_JUMPER; Component Kind: Standard; Component Type: Standard; Pin Count: 2; Value: 0; Status: Preferred; Manufacturer Part Number: R0603_0R_JUMPER; Case: 0603; Mounted: Yes; Sense: No; Socket: No; SMD: Yes; Manufacturer1 Example: NIC COMPONENT; Manufacturer1 ComponentHeight: 0.55mm; HelpURL: \\cern.ch\dfs\Applications\Altium\Datasheets\R0603_NIC_NRC.pdf; Author: CERN DEM JLC; CreateDate: 03.12.2007; LatestRevisionDate: 13.03.2008

## Sheet FE_LDOs.SchDoc: FMC SDR Frontend
size 420 x 297 mm; EDA_Number: EDA-XXXXX-VX-X; Projet: -; ModifiedBy: -; CreateDate: XX/XX/XXXX; CheckedDate: -; Title2: Power Supply LDOs; DivGrp: TE/MPE; Designer: Designer
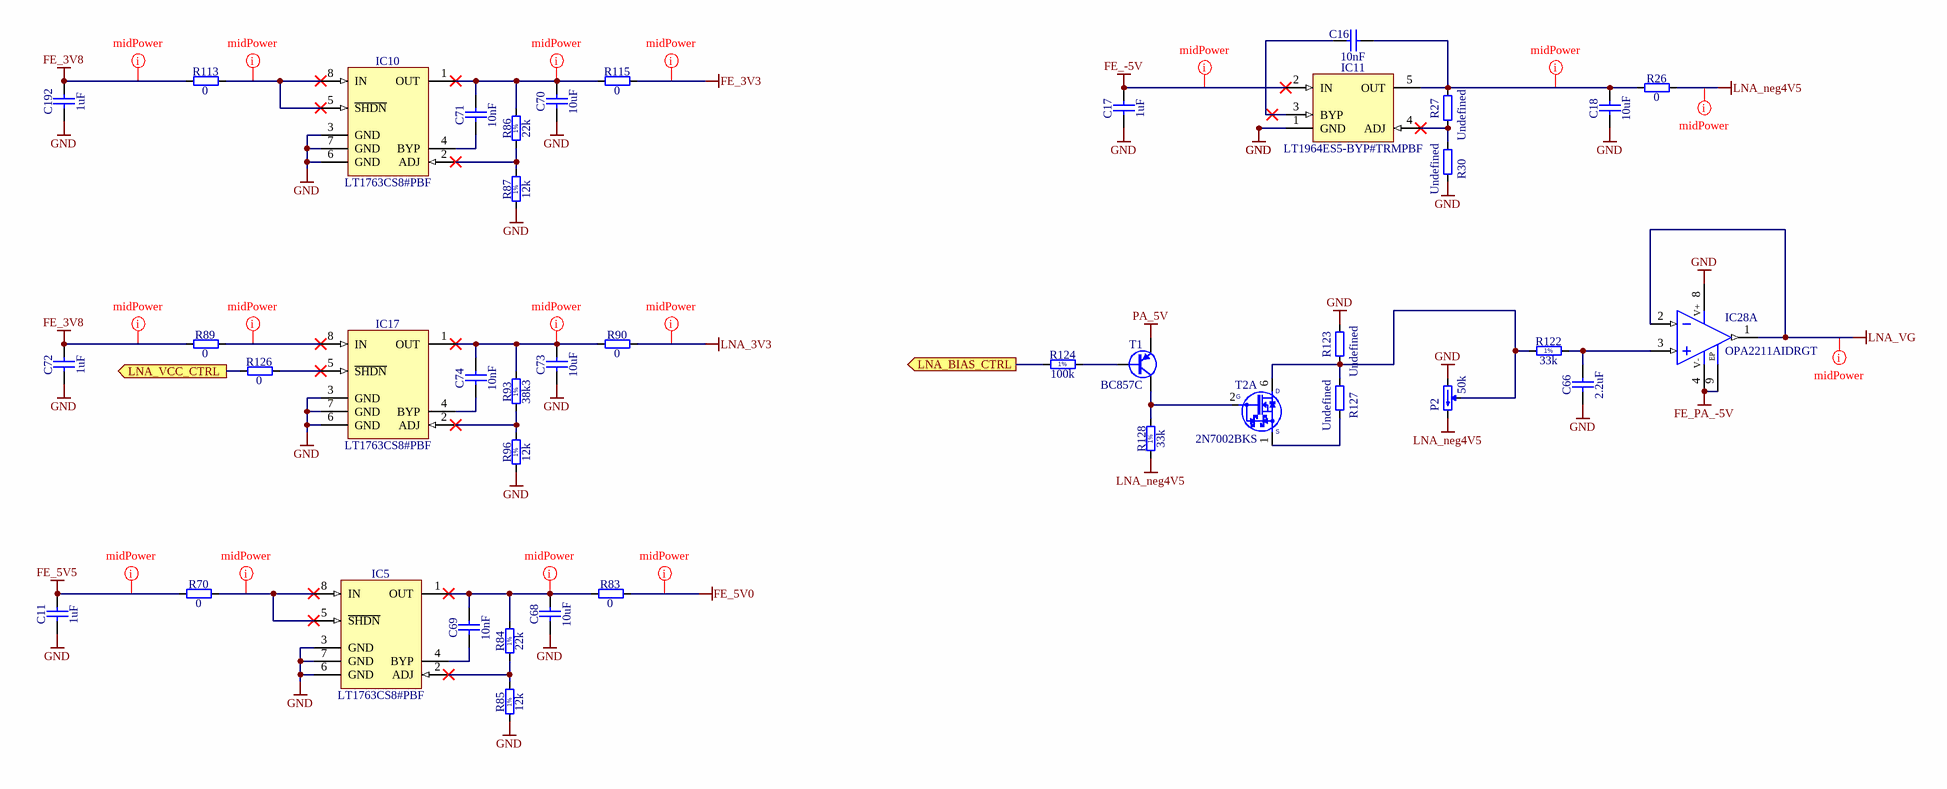
[diagram p4: FE_LDOs.SchDoc]

### Parts
C11  1uF  [CAPC1608X87N]
C16  10nF  [CAPC1608X87N]
C17  1uF  [CAPC1608X87N]
C18  10uF  [CAPC2012X95N]
C66  2.2uF  [CAPC2012X135N]
C68  10uF  [CAPC2012X95N]
C69  10nF  [CAPC1005X55N]
C70  10uF  [CAPC2012X95N]
C71  10nF  [CAPC1005X55N]
C72  1uF  [CAPC1608X87N]
C73  10uF  [CAPC2012X95N]
C74  10nF  [CAPC1005X55N]
C192  1uF  [CAPC1608X87N]
IC5  LT1763CS8#PBF  [SOIC127P600X175-8N]
IC10  LT1763CS8#PBF  [SOIC127P600X175-8N]
IC11  LT1964ES5-BYP#TRMPBF  [SOT95P280X100-5N]
IC17  LT1763CS8#PBF  [SOIC127P600X175-8N]
IC28  OPA2211AIDRGT  [SON50P300X300X80-9N-R155X250]  (part A of 2)
P2  50k  [TRIM_BOURNS_3223W]
R26  0  [RESC1608X55N]
R27  Undefined  [RESC1608X55N]
R30  Undefined  [RESC1608X55N]
R70  0  [RESC1608X55N]
R83  0  [RESC1608X55N]
R84  22k  [RESC1005X40N]
R85  12k  [RESC1005X40N]
R86  22k  [RESC1005X40N]
R87  12k  [RESC1005X40N]
R89  0  [RESC1608X55N]
R90  0  [RESC1608X55N]
R93  38k3  [RESC1005X40N]
R96  12k  [RESC1005X40N]
R113  0  [RESC1608X55N]
R115  0  [RESC1608X55N]
R122  33k  [RESC1005X40N]
R123  Undefined  [RESC1608X55N]
R124  100k  [RESC1608X55N]
R126  0  [RESC1608X55N]
R127  Undefined  [RESC1608X55N]
R128  33k  [RESC1608X55N]
T1  BC857C  [SOT95P240X110-3N]
T2  2N7002BKS  [SOT65P210X110-6N]  (part A of 2)

### Ports
LNA_BIAS_CTRL (out), LNA_VCC_CTRL (out)

### Nets
FE_3V3: R115.2
FE_3V8: C72.2 C192.2 R89.1 R113.1
FE_5V0: R83.2
FE_5V5: C11.2 R70.1
FE_-5V: C17.2 IC11.2(IN)
FE_PA_-5V: IC28.4(V-) IC28.9(Exposed_Pad)
GND: C11.1 C17.1 C18.1 C66.1 C68.1 C70.1 C72.1 C73.1 C192.1 IC5.3(GND) IC5.6(GND) IC5.7(GND) IC10.3(GND) IC10.6(GND) IC10.7(GND) IC11.1(GND) IC17.3(GND) IC17.6(GND) IC17.7(GND) IC28.8(V+) P2.1(CCW) R30.1 R85.1 R87.1 R96.1 R123.2
LNA_3V3: R90.2
LNA_neg4V5: P2.3(CW) R26.2 R128.1
LNA_VG: IC28.1(OUT) IC28.2(IN-)
PA_5V: T1.2(E)
Bias_Up: R124.1 ; port LNA_BIAS_CTRL
LNA_VCC_Up: R126.1 ; port LNA_VCC_CTRL
NetC16_1: C16.1 IC11.3(BYP)
NetC16_2: C16.2 C18.2 IC11.5(OUT) R26.1 R27.2
NetC66_2: C66.2 IC28.3(IN+) R122.2
NetC68_2: C68.2 C69.2 IC5.1(OUT) R83.1 R84.2
NetC69_1: C69.1 IC5.4(BYP)
NetC70_2: C70.2 C71.2 IC10.1(OUT) R86.2 R115.1
NetC71_1: C71.1 IC10.4(BYP)
NetC73_2: C73.2 C74.2 IC17.1(OUT) R90.1 R93.2
NetC74_1: C74.1 IC17.4(BYP)
NetIC5_2: IC5.2(ADJ) R84.1 R85.2
NetIC5_5: IC5.5(~{SHDN}) IC5.8(IN) R70.2
NetIC10_2: IC10.2(ADJ) R86.1 R87.2
NetIC10_5: IC10.5(~{SHDN}) IC10.8(IN) R113.2
NetIC11_4: IC11.4(ADJ) R27.1 R30.2
NetIC17_2: IC17.2(ADJ) R93.1 R96.2
NetIC17_5: IC17.5(~{SHDN}) R126.2
NetIC17_8: IC17.8(IN) R89.2
NetP2_2: P2.2(W) R122.1 R123.1 R127.2 T2.6(D)
NetR124_2: R124.2 T1.1(B)
NetR127_1: R127.1 T2.1(S)
NetR128_2: R128.2 T1.3(C) T2.2(G)

### Layout directives
net class midPower: FE_3V3, FE_3V8, FE_5V0, FE_5V5, FE_-5V, LNA_3V3, LNA_neg4V5, LNA_VG, NetC16_2, NetC68_2, NetC70_2, NetC73_2, NetIC5_5, NetIC10_5, NetIC17_8

### Notes on the sheet
- (near R26) Starting from -4.5V
- Project/Equipment
- Document
- Designer
- Drawn by
- Check.by
- File
- Last Mod.
- Print Date
- Sheet
- Size
- A3
- of
- Rev
- (in symbol OPA2211AIDRGT, part A) EP
- (in symbol R0402_12K_1%_0.0625W_100PPM) 1%
- (in symbol R0402_22K_1%_0.0625W_100PPM) 1%
- (in symbol R0402_33K_1%_0.0625W_100PPM) 1%
- (in symbol R0402_38K3_1%_0.0625W_100PPM) 1%
- (in symbol R0603_33K_1%_0.1W_100PPM) 1%
- (in symbol R0603_100K_1%_0.1W_100PPM) 1%

### Library data of the parts
C11 C17 C72 C192 = CC0603_1UF_25V_10%_X7R: Non-polarised capacitor; Part Description: SMD Multilayer Chip Ceramic Capacitor; Manufacturer: GENERIC; Manufacturer1 Part Number: GRM188R71E105KA12D; Voltage: 25V; TC: X7R; Tolerance: ±10%; Part Number: CC0603_1UF_25V_10%_X7R; Component Kind: Standard; Component Type: Standard; Pin Count: 2; Value: 1uF; Status: None; Manufacturer Part Number: CC0603_1UF_25V_10%_X7R; Case: 0603; Mounted: Yes; Socket: No; SMD: Yes; Sense: No; Manufacturer1 Example: MURATA; Manufacturer1 ComponentHeight: 0.9mm; HelpURL: \\cern.ch\dfs\Applications\Altium\Datasheets\CC0603_X7R_MURATA.pdf; Author: CERN DEM JLC; CreateDate: 18/01/2011; LatestRevisionDate: 18/01/2011
C16 = CC0603_10NF_50V_5%_C0G: Non-polarised capacitor; Part Description: SMD Multilayer Chip Ceramic Capacitor; Manufacturer: GENERIC; Manufacturer1 Part Number: C1608C0G1H103J080AA; Voltage: 50V; TC: C0G/NP0; Tolerance: ±5%; Part Number: CC0603_10NF_50V_5%_C0G; Component Kind: Standard; Component Type: Standard; Pin Count: 2; Value: 10nF; Status: Preferred; Manufacturer Part Number: CC0603_10NF_50V_5%_C0G; Case: 0603; Mounted: Yes; Socket: No; SMD: Yes; Sense: No; Manufacturer1 Example: TDK; Manufacturer1 ComponentHeight: 0.9mm; HelpURL: \\cern.ch\dfs\Applications\Altium\Datasheets\CC0603_C0G_TDK_C.pdf; Author: CERN DEM JLC; CreateDate: 10.12.2014; LatestRevisionDate: 10.12.2014
C18 C68 C70 C73 = CC0805_10UF_25V_10%_X5R: as C93 on sheet LTM8074neg_PA; Part Number: CC0805_10UF_25V_10%_X5R; Component Kind: Standard; Component Type: Standard; Pin Count: 2; Value: 10uF; Status: Preferred; Manufacturer Part Number: CC0805_10UF_25V_10%_X5R; Case: 0805; Mounted: Yes; Socket: No; SMD: Yes; Sense: No; Manufacturer1 Example: MURATA; Manufacturer1 ComponentHeight: 0.95mm; HelpURL: \\cern.ch\dfs\Applications\Altium\Datasheets\CC0805_X5R_MURATA_GRM.pdf; Author: CERN DEM JLC; CreateDate: 25/10/2012; LatestRevisionDate: 06/09/2016
C66 = CC0805_2.2UF_16V_10%_X7R: Non-polarised capacitor; Part Description: SMD Multilayer Chip Ceramic Capacitor; Manufacturer: GENERIC; Manufacturer1 Part Number: GRM21BF51C225ZA01L; Voltage: 16V; TC: X7R; Tolerance: ±10%; Part Number: CC0805_2.2UF_16V_10%_X7R; Component Kind: Standard; Component Type: Standard; Pin Count: 2; Value: 2.2uF; Status: Preferred; Manufacturer Part Number: CC0805_2.2UF_16V_10%_X7R; Case: 0805; Mounted: Yes; Socket: No; SMD: Yes; Sense: No; Manufacturer1 Example: MURATA; Manufacturer1 ComponentHeight: 1.5mm; HelpURL: \\cern.ch\dfs\Applications\Altium\Datasheets\CC0805_X7R_MURATA_GRM.pdf; Author: CERN DEM JLC; CreateDate: 03.12.2007; LatestRevisionDate: 18.09.2014
C69 C71 C74 = CC0402_10NF_50V_10%_X7R: Non-polarised capacitor; Part Description: SMD Multilayer Chip Ceramic Capacitor; Manufacturer: GENERIC; Manufacturer1 Part Number: GRM155R71H103KA88D; Voltage: 50V; TC: X7R; Tolerance: ±10%; Part Number: CC0402_10NF_50V_10%_X7R; Component Kind: Standard; Component Type: Standard; Pin Count: 2; Value: 10nF; Status: None; Manufacturer Part Number: CC0402_10NF_50V_10%_X7R; Case: 0402; Mounted: Yes; Socket: No; SMD: Yes; Sense: No; Manufacturer1 Example: MURATA; Manufacturer1 ComponentHeight: 0.55mm; HelpURL: \\cern.ch\dfs\Applications\Altium\Datasheets\CC0402_X7R_MURATA_GRM.pdf; Author: CERN DEM MR; CreateDate: 08.01.2016; LatestRevisionDate: 08.01.2016
IC5 IC10 IC17 = LT1763CS8#PBF: 1.22V to 20V 500mA, Low Noise, LDO Adjustable Micropower Regulator; Manufacturer: LINEAR TECHNOLOGY; PressFit: No; Bonding: No; Part Number: LT1763CS8#PBF; Component Kind: Standard; Component Type: Standard; Device: LT1763CS8#PBF; PackageDescription: SOIC 8, Pitch 1.27mm, Body 4x5mm, IPC Medium Density; Part Description: 1.22V to 20V 500mA, Low Noise, LDO Adjustable Micropower Regulator; Manufacturer Part Number: LT1763CS8#PBF; Pin Count: 8; Case: SOIC8; Mounted: Yes; Socket: No; SMD: Yes; Sense: No; ComponentHeight: 1.75mm; HelpURL: \\cern.ch\dfs\Applications\Altium\Datasheets\LT1763CS8#PBF.pdf; Author: CERN DEM JLC; CreateDate: 11.01.2010; LatestRevisionDate: 11.01.2010
IC11 = LT1964ES5-BYP#TRMPBF: 200mA, Low Noise, Low Dropout Negative Micropower Regulator; Part Description: -1.22V to -20V, 200mA, Low Noise, Low Dropout Negative Micropower Regulator; Manufacturer: LINEAR TECHNOLOGY; PressFit: No; Bonding: No; Part Number: LT1964ES5-BYP#TRMPBF; Component Kind: Standard; Component Type: Standard; Device: LT1964ES5-BYP#TRMPBF; PackageDescription: SOT23, 0.95mm pitch; 5 pin, 1.75mm W X 3.00mm L, IPC Medium Density; Manufacturer Part Number: LT1964ES5-BYP#TRMPBF; Pin Count: 5; Case: SOT23-5; Mounted: Yes; Socket: No; SMD: Yes; Sense: No; ComponentHeight: 1mm; HelpURL: \\cern.ch\dfs\Applications\Altium\Datasheets\LT1964ES5-BYP#TRMPBF.pdf; Author: CERN DEM MR; CreateDate: 17.02.2016; LatestRevisionDate: 17.02.2016
IC28 = OPA2211AIDRGT: Dual Operational Amplifier With Exposed Pad; Part Description: 1.1nV/sqrt Hz Noise, Low Power, PrecisionOperational Amplifier; Manufacturer: TEXAS INSTRUMENTS; PressFit: No; Bonding: No; Part Number: OPA2211AIDRGT; Component Kind: Standard; Component Type: Standard; Device: OPA2211AIDRGT; PackageDescription: SON,  0.50mm Pitch, 8 Pin, 3mm X 3mm X 0.8mm H Body (w/Thermal Tab 1.55 X 2.5mm),  IPC Medium Density; Manufacturer Part Number: OPA2211AIDRGT; Pin Count: 9; Case: SON8; Mounted: Yes; Socket: No; SMD: Yes; Sense: No; ComponentHeight: 0.8mm; Author: CERN DEM JLC; HelpURL: \\cern.ch\dfs\Applications\Altium\Datasheets\OPA2211AIDRGT.pdf; CreateDate: 17.11.2014; LatestRevisionDate: 17.11.2014
P2 = TRIM_11T_50K_BOURNS_3223W-1-503E: Trimming Potentiometer; Part Description: 11 Turns SMD Trimpot® Trimming Potentiometer (Top Adjust); Manufacturer: BOURNS; Power: 0.125W; TC: ±100ppm/°C; Tolerance: ±20%; PressFit: No; Part Number: TRIM_11T_50K_BOURNS_3223W-1-503E; Component Kind: Standard; Component Type: Standard; Pin Count: 3; Value: 50k; Manufacturer Part Number: 3223W-1-503E; Case: 3223W; Mounted: Yes; Socket: No; SMD: Yes; Sense: No; ComponentHeight: 4.16mm; HelpURL: \\cern.ch\dfs\Applications\Altium\Datasheets\TRIM_BOURNS_3223W.pdf; Author: CERN DEM JLC; CreateDate: 31.03.2011; LatestRevisionDate: 18.12.2012
R26 R70 R83 R89 R90 R113 R115 R126 = R0603_0R_JUMPER: as R22#1 on sheet FrontEnd_PS; Part Number: R0603_0R_JUMPER; Component Kind: Standard; Component Type: Standard; Pin Count: 2; Value: 0; Status: Preferred; Manufacturer Part Number: R0603_0R_JUMPER; Case: 0603; Mounted: Yes; Sense: No; Socket: No; SMD: Yes; Manufacturer1 Example: NIC COMPONENT; Manufacturer1 ComponentHeight: 0.55mm; HelpURL: \\cern.ch\dfs\Applications\Altium\Datasheets\R0603_NIC_NRC.pdf; Author: CERN DEM JLC; CreateDate: 03.12.2007; LatestRevisionDate: 13.03.2008
R27 R30 R123 R127 = R0603_NO-VALUE: as R20 on sheet FrontEnd_PS; Part Number: R0603_NO-VALUE; Component Kind: Standard; Component Type: Standard; Pin Count: 2; Value: Undefined; Status: None; Manufacturer: Undefined; Manufacturer Part Number: R0603_NO-VALUE; Case: 0603; Sense: No; Socket: No; SMD: Yes; Manufacturer1 Example: Undefined; Manufacturer1 Part Number: Undefined; Manufacturer1 ComponentHeight: Undefined; HelpURL: Undefined; Author: CERN DEM JLC; CreateDate: 03.12.2007; LatestRevisionDate: 13.03.2008
R84 R86 = R0402_22K_1%_0.0625W_100PPM: Resistor - 1%; Part Description: General Purpose Thick Film Chip Resistor; Manufacturer: GENERIC; Manufacturer1 Part Number: 232270672203L; TC: ±100ppm/°C; PressFit: No; Part Number: R0402_22K_1%_0.0625W_100PPM; Component Kind: Standard; Component Type: Standard; Pin Count: 2; Value: 22k; Status: Not Recommended; Power: 0.0625W; Tolerance: ±1%; Manufacturer Part Number: R0402_22K_1%_0.0625W_100PPM; Case: 0402; Mounted: Yes; Sense: No; Socket: No; SMD: Yes; Manufacturer1 Example: YAGEO PHYCOMP; Manufacturer1 ComponentHeight: 0.4mm; HelpURL: \\cern.ch\dfs\Applications\Altium\Datasheets\R0402_Phycomp_RC0402.pdf; Author: CERN DEM JLC; CreateDate: 03.12.2007; LatestRevisionDate: 17.10.2012
R85 R87 R96 = R0402_12K_1%_0.0625W_100PPM: Resistor - 1%; Part Description: General Purpose Thick Film Chip Resistor; Manufacturer: GENERIC; Manufacturer1 Part Number: 232270671203L; TC: ±100ppm/°C; PressFit: No; Part Number: R0402_12K_1%_0.0625W_100PPM; Component Kind: Standard; Component Type: Standard; Pin Count: 2; Value: 12k; Status: Not Recommended; Power: 0.0625W; Tolerance: ±1%; Manufacturer Part Number: R0402_12K_1%_0.0625W_100PPM; Case: 0402; Mounted: Yes; Sense: No; Socket: No; SMD: Yes; Manufacturer1 Example: YAGEO PHYCOMP; Manufacturer1 ComponentHeight: 0.4mm; HelpURL: \\cern.ch\dfs\Applications\Altium\Datasheets\R0402_Phycomp_RC0402.pdf; Author: CERN DEM JLC; CreateDate: 03.12.2007; LatestRevisionDate: 17.10.2012
R93 = R0402_38K3_1%_0.0625W_100PPM: Resistor - 1%; Part Description: General Purpose Thick Film Chip Resistor; Manufacturer: GENERIC; Manufacturer1 Part Number: 232270673833L or RC0402FR-0738K3L; TC: ±100ppm/°C; PressFit: No; Part Number: R0402_38K3_1%_0.0625W_100PPM; Component Kind: Standard; Component Type: Standard; Pin Count: 2; Value: 38k3; Status: Not Recommended; Power: 0.0625W; Tolerance: ±1%; Manufacturer Part Number: R0402_38K3_1%_0.0625W_100PPM; Case: 0402; Mounted: Yes; Sense: No; Socket: No; SMD: Yes; Manufacturer1 Example: YAGEO PHYCOMP; Manufacturer1 ComponentHeight: 0.4mm; HelpURL: \\cern.ch\dfs\Applications\Altium\Datasheets\R0402_Phycomp_RC0402.pdf; Author: CERN DEM BC; CreateDate: 29.07.2015; LatestRevisionDate: 29.07.2015
R122 = R0402_33K_1%_0.0625W_100PPM: Resistor - 1%; Part Description: General Purpose Thick Film Chip Resistor; Manufacturer: GENERIC; Manufacturer1 Part Number: 232270673303L; TC: ±100ppm/°C; PressFit: No; Part Number: R0402_33K_1%_0.0625W_100PPM; Component Kind: Standard; Component Type: Standard; Pin Count: 2; Value: 33k; Status: Not Recommended; Power: 0.0625W; Tolerance: ±1%; Manufacturer Part Number: R0402_33K_1%_0.0625W_100PPM; Case: 0402; Mounted: Yes; Sense: No; Socket: No; SMD: Yes; Manufacturer1 Example: YAGEO PHYCOMP; Manufacturer1 ComponentHeight: 0.4mm; HelpURL: \\cern.ch\dfs\Applications\Altium\Datasheets\R0402_Phycomp_RC0402.pdf; Author: CERN DEM JLC; CreateDate: 03.12.2007; LatestRevisionDate: 17.10.2012
R124 = R0603_100K_1%_0.1W_100PPM: Resistor - 1%; Part Description: General Purpose Thick Film Chip Resistor; Manufacturer: GENERIC; Manufacturer1 Part Number: NRC06F1003TRF; Power: 0.1W; TC: ±100ppm/°C; PressFit: No; Part Number: R0603_100K_1%_0.1W_100PPM; Component Kind: Standard; Component Type: Standard; Pin Count: 2; Value: 100k; Status: Preferred; Tolerance: ±1%; Manufacturer Part Number: R0603_100K_1%_0.1W_100PPM; Case: 0603; Mounted: Yes; Sense: No; Socket: No; SMD: Yes; Manufacturer1 Example: NIC COMPONENT; Manufacturer1 ComponentHeight: 0.55mm; HelpURL: \\cern.ch\dfs\Applications\Altium\Datasheets\R0603_NIC_NRC.pdf; Author: CERN DEM JLC; CreateDate: 03.12.2007; LatestRevisionDate: 13.03.2008
R128 = R0603_33K_1%_0.1W_100PPM: Resistor - 1%; Part Description: General Purpose Thick Film Chip Resistor; Manufacturer: GENERIC; Manufacturer1 Part Number: NRC06F3302TRF; Power: 0.1W; TC: ±100ppm/°C; PressFit: No; Part Number: R0603_33K_1%_0.1W_100PPM; Component Kind: Standard; Component Type: Standard; Pin Count: 2; Value: 33k; Status: Preferred; Tolerance: ±1%; Manufacturer Part Number: R0603_33K_1%_0.1W_100PPM; Case: 0603; Mounted: Yes; Sense: No; Socket: No; SMD: Yes; Manufacturer1 Example: NIC COMPONENT; Manufacturer1 ComponentHeight: 0.55mm; HelpURL: \\cern.ch\dfs\Applications\Altium\Datasheets\R0603_NIC_NRC.pdf; Author: CERN DEM JLC; CreateDate: 03.12.2007; LatestRevisionDate: 13.03.2008
T1 = BC857C: PNP Transistor; Part Description: 45V 100mA PNP  Silicon AF Transistor; Manufacturer: INFINEON; PressFit: No; Bonding: No; Part Number: BC857C; Component Kind: Standard; Component Type: Standard; Device: BC857C; PackageDescription: SOT23 3-Leads, Pitch 0.95mm - Body 1.3x2.9mm, IPC Medium Density; Manufacturer Part Number: BC857C; Pin Count: 3; Case: SOT23-3; Mounted: Yes; Socket: No; SMD: Yes; Sense: No; ComponentHeight: 1.1mm; HelpURL: \\cern.ch\dfs\Applications\Altium\Datasheets\BC857C.pdf; Author: CERN DEM JLC; CreateDate: 23.09.2014; LatestRevisionDate: 23.09.2014
T2 = 2N7002BKS: 60V, 300mA Dual N-Channel Trench MOSFET; Manufacturer: NXP SEMICONDUCTORS; Manufacturer Part Number: 2N7002BKS6; PressFit: No; Bonding: No; Part Number: 2N7002BKS; Component Kind: Standard; Component Type: Standard; Device: 2N7002BKS; PackageDescription: SOT363, SC70-6, SOT, 0.65mm Pitch, 6 pin, 1.25mm W X 2.00mm L X 1.10mm H, IPC Medium Density; Part Description: 60 V, 300 mA Dual N-Channel Trench MOSFET; Pin Count: 4; Case: SOT363; Mounted: Yes; Socket: No; SMD: Yes; Sense: No; ComponentHeight: 1.1mm; HelpURL: \\cern.ch\dfs\Applications\Altium\Datasheets\2N7002BKS.pdf; Author: CERN DEM JLC; CreateDate: 27.11.2012; LatestRevisionDate: 27.11.2012